# EAGLE design mbeduino010.eagle6 (EAGLE 6.5.0)
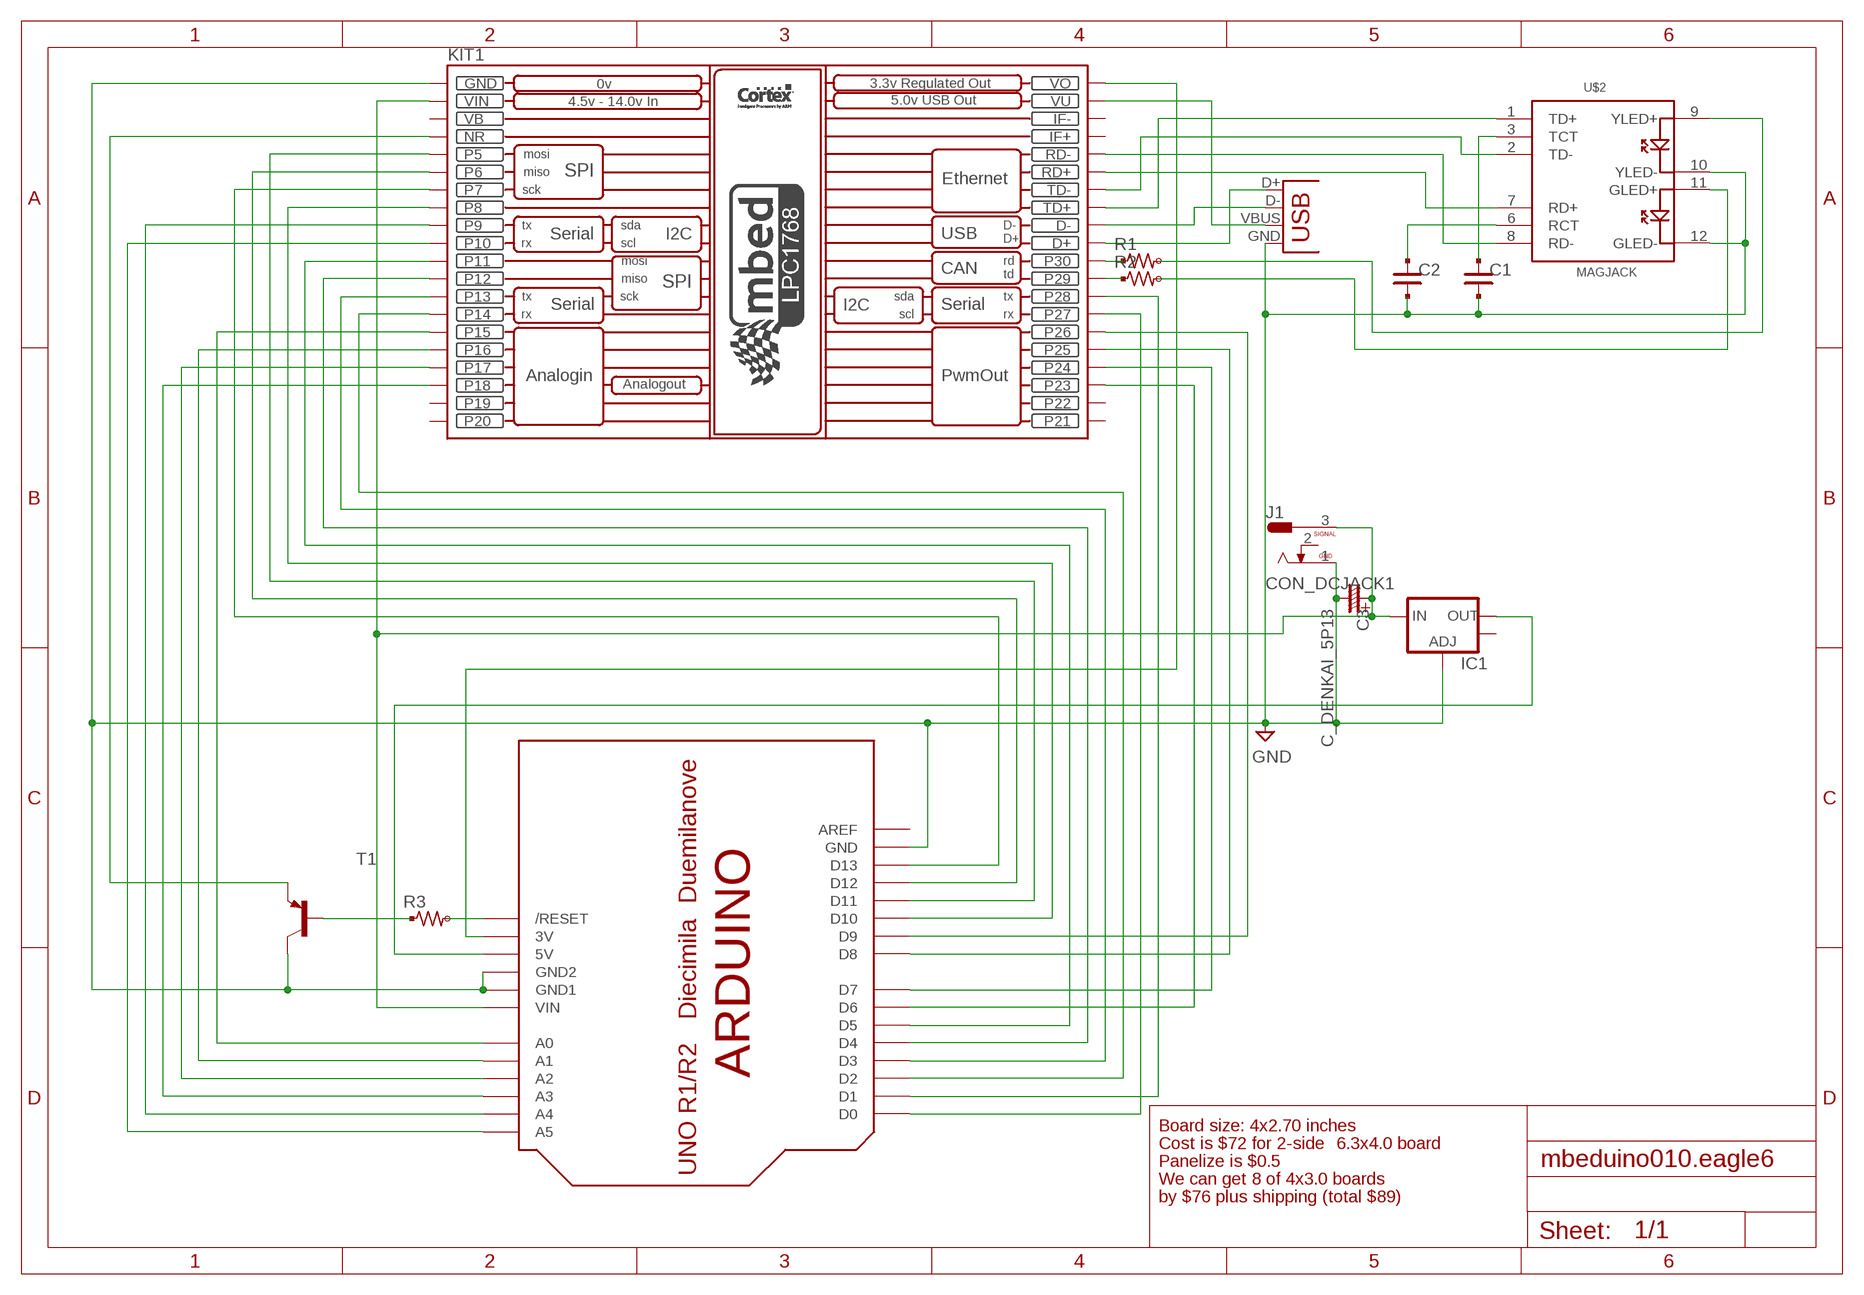
[diagram p0: schematic, sheet 1]

## Parts
C1  C_PAD_PAD_2125  [CR_2125]
C2  C_PAD_PAD_2125  [CR_2125]
C3  C_DENKAI_5P13  C_DENKAI_2.5P6  [C_2.5PHI6]
IC1  V_REG_LM1117SOT223  [SOT223]
J1  CON_DCJACK1  [CON_DCJACK]
KIT1  MBED_NXP_LPC1768  [MBED-KIT]
R1  R_US_PAD_VIA_2125  [R_2125_PADVIA]
R2  R_US_PAD_VIA_2125  [R_2125_PADVIA]
R3  R_US_PAD_VIA_2125  [R_2125_PADVIA]
T1  -PNP-SOT23-BCE  [SOT23-BCE]
U$1  ARDUINO-NOHOLE  [ARDUINO-NOHOLE]
U$2  MAGJACK  [MAGJACK]
X1  USB-A-S  [USB-A-S]

## Nets
GND: C1.2 C2.2 C3.- IC1.1(ADJ) J1.1 KIT1.GND T1.C U$1.GND U$1.GND1 U$1.GND2 U$2.10(YLED-) U$2.12(GLED-) X1.GND
N$1: KIT1.NR T1.E
N$2: C3.+ IC1.3(IN) J1.3 KIT1.VIN U$1.VIN
N$3: KIT1.VOUT(VO) U$1.3V
N$4: KIT1.P$15(P15) U$1.A0
N$5: KIT1.P$16(P16) U$1.A1
N$6: KIT1.P$17(P17) U$1.A2
N$7: KIT1.P$18(P18) U$1.A3
N$8: KIT1.P$9(P9) U$1.A4
N$9: KIT1.P$10(P10) U$1.A5
N$10: KIT1.P$27(P27) U$1.D0
N$11: KIT1.P$28(P28) U$1.D1
N$12: KIT1.P$14(P14) U$1.D2
N$13: KIT1.P$13(P13) U$1.D3
N$14: KIT1.P$12(P12) U$1.D4
N$15: KIT1.P$11(P11) U$1.D5
N$16: KIT1.P$23(P23) U$1.D6
N$17: KIT1.P$24(P24) U$1.D7
N$18: KIT1.P$25(P25) U$1.D8
N$19: KIT1.P$26(P26) U$1.D9
N$20: KIT1.P$8(P8) U$1.D10
N$21: KIT1.P$5(P5) U$1.D11
N$22: KIT1.P$6(P6) U$1.D12
N$23: KIT1.P$7(P7) U$1.D13
N$24: KIT1.D- X1.D-
N$25: KIT1.D+ X1.D+
N$26: KIT1.VU X1.VBUS
N$27: R3.PAD T1.B
N$28: R3.VIA U$1.RESET(/RESET)
N$29: C1.1 U$2.3(TCT)
N$30: C2.1 U$2.6(RCT)
N$31: KIT1.RD+ U$2.7(RD+)
N$32: KIT1.RD- U$2.8(RD-)
N$33: KIT1.TD- U$2.2(TD-)
N$34: KIT1.TD+ U$2.1(TD+)
N$35: IC1.2(OUT) U$1.5V
N$36: KIT1.P$30(P30) R1.PAD
N$37: KIT1.P$29(P29) R2.PAD
N$39: R1.VIA U$2.9(YLED+)
N$40: R2.VIA U$2.11(GLED+)
Unconnected: IC1.4(OUT) J1.2 KIT1.IF+ KIT1.IF- KIT1.P$19(P19) KIT1.P$20(P20) KIT1.P$21(P21) KIT1.P$22(P22) U$1.AREF

## Notes on the sheet
- Board size: 4x2.70 inches
- Cost is $72 for 2-side | 6.3x4.0 board
- Panelize is $0.5
- We can get 8 of 4x3.0 boards
- by $76 plus shipping (total $89)

## Power pins joined to a net without a drawn wire
VB: KIT1.VB

## Library data of the parts
C1 C2 = mylib:C_PAD_PAD_: SMD CAPACITOR : PAD - PAD
C3 = mylib:C_DENKAI: (Device name) : (Main function of the device) Packages : (Variant name1) : (Pitch) x (Pin) x (Width) (Variant name2) : (Pitch) x (Pin) x (Width) (Variant name3) : (Pitch) x (Pin) x (Width) ...
IC1 = SparkFun:V_REG_LM1117: Voltage Regulator LM1117 Standard adjustable voltage regulator but in SMD form. Spark Fun Electronics SKU : COM-00595
J1 = mylib:CON_DCJACK: DC JACK : 2.1 / 2.5 mm
KIT1 = MBED_v2.1:MBED_NXP_LPC1768: Mbed LPC1768 - ARM CORTEX v2.1 * Schematic symbol is now placed in eagles's default raster. *The pads diameter are suitable for routing between mbed pins * mbed pads are 0.8 mm drill diameter. --------------------------------------------- Created by: Mohamed Yousry *Alexandria, Egypt *Email: mohamed.yousry@ieeegoldegypt.org
R1-R3 = mylib:R_US_PAD_VIA: R_US_PAD_PAD : SMD R PAD is TH-NTH Packages : _1608 : 1.6 x 0.8 mm _2125 : 2.0 x 1.25 mm _3216 : 3.2 x 1.6 mm
T1 = transistor:*-PNP-: PNP Transistror
U$1 = adafruit (1):ARDUINO: Arduino Diecimila/Duemilanove Make a shield with ease, this package has all the named pins as well as the two mounting drill holes and an outline of the USB and DC power connector. The outline is on the DIMENSION layer, so if your board house uses it they will cut the outline to match. http://www.ladyada.net/library/pcb/eaglelibrary.html
U$2 = SparkFun:MAGJACK
X1 = SparkFun:USB: USB Connectors USB-B-PTH is fully proven SKU : PRT-00139 USB-miniB is fully proven SKU : PRT-00587 USB-A-PCB is untested. USB-A-H is throughly reviewed, but untested. Spark Fun Electronics SKU : PRT-00437 USB-B-SMT is throughly reviewed, but untested. Needs silkscreen touching up. USB-A-S has not been used/tested USB-MB-H has not been used/tested

## Net classes
0 signal: width 0.406 mm, drill 0.61 mm
1 power: width 0.813 mm, drill 0.61 mm

## Board
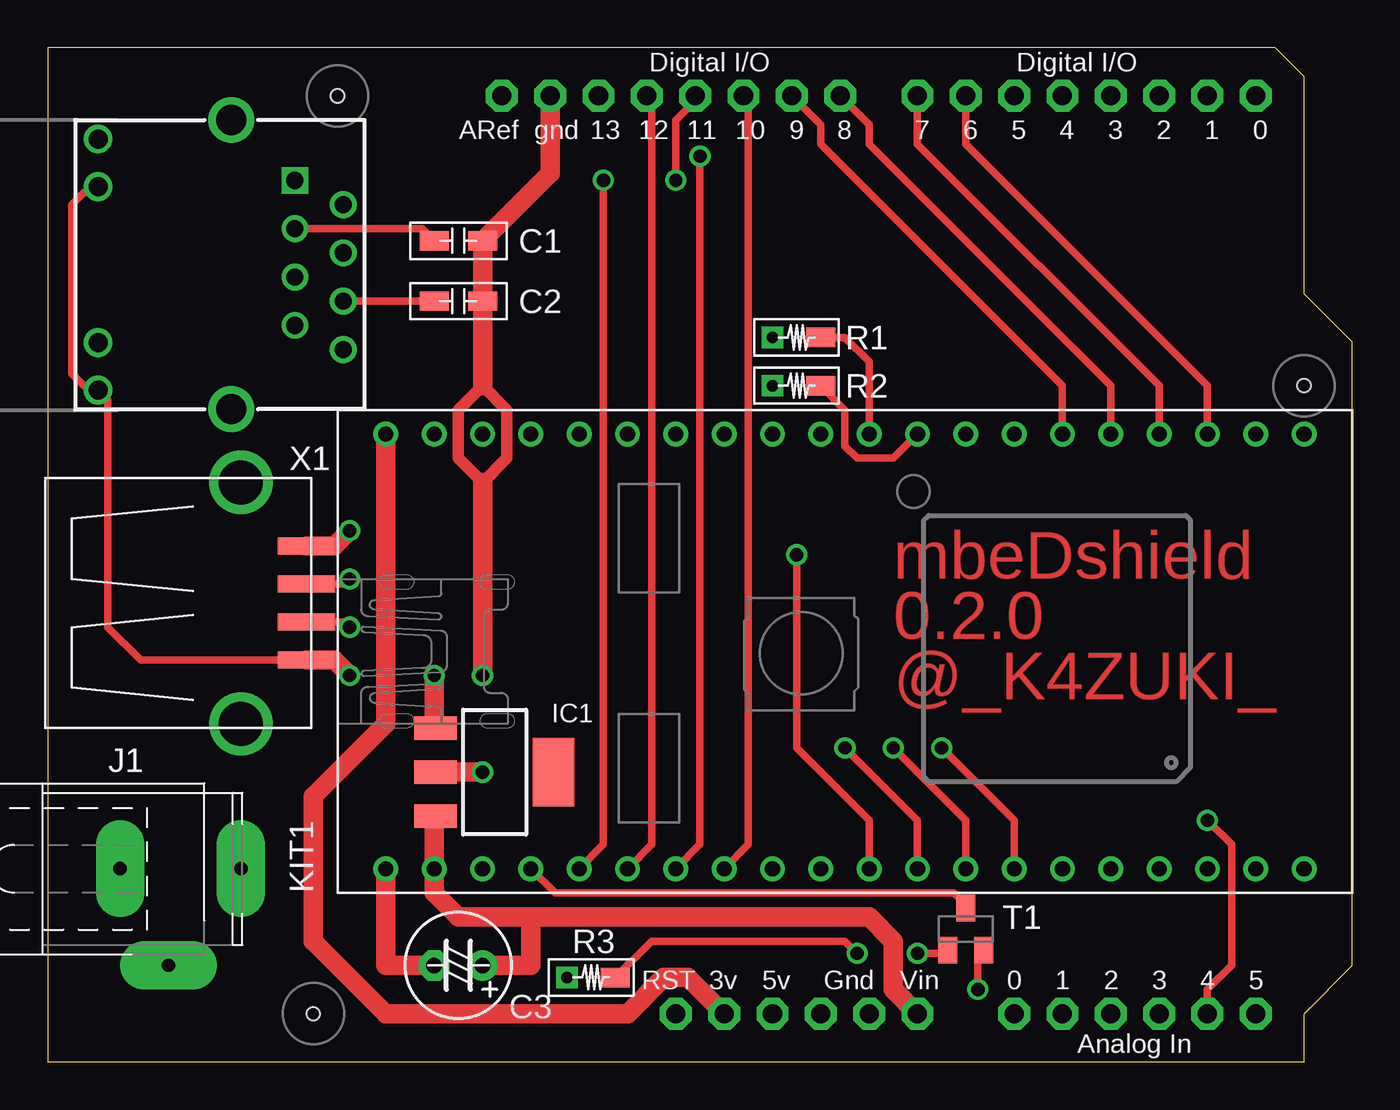
[diagram p1: board, top side]
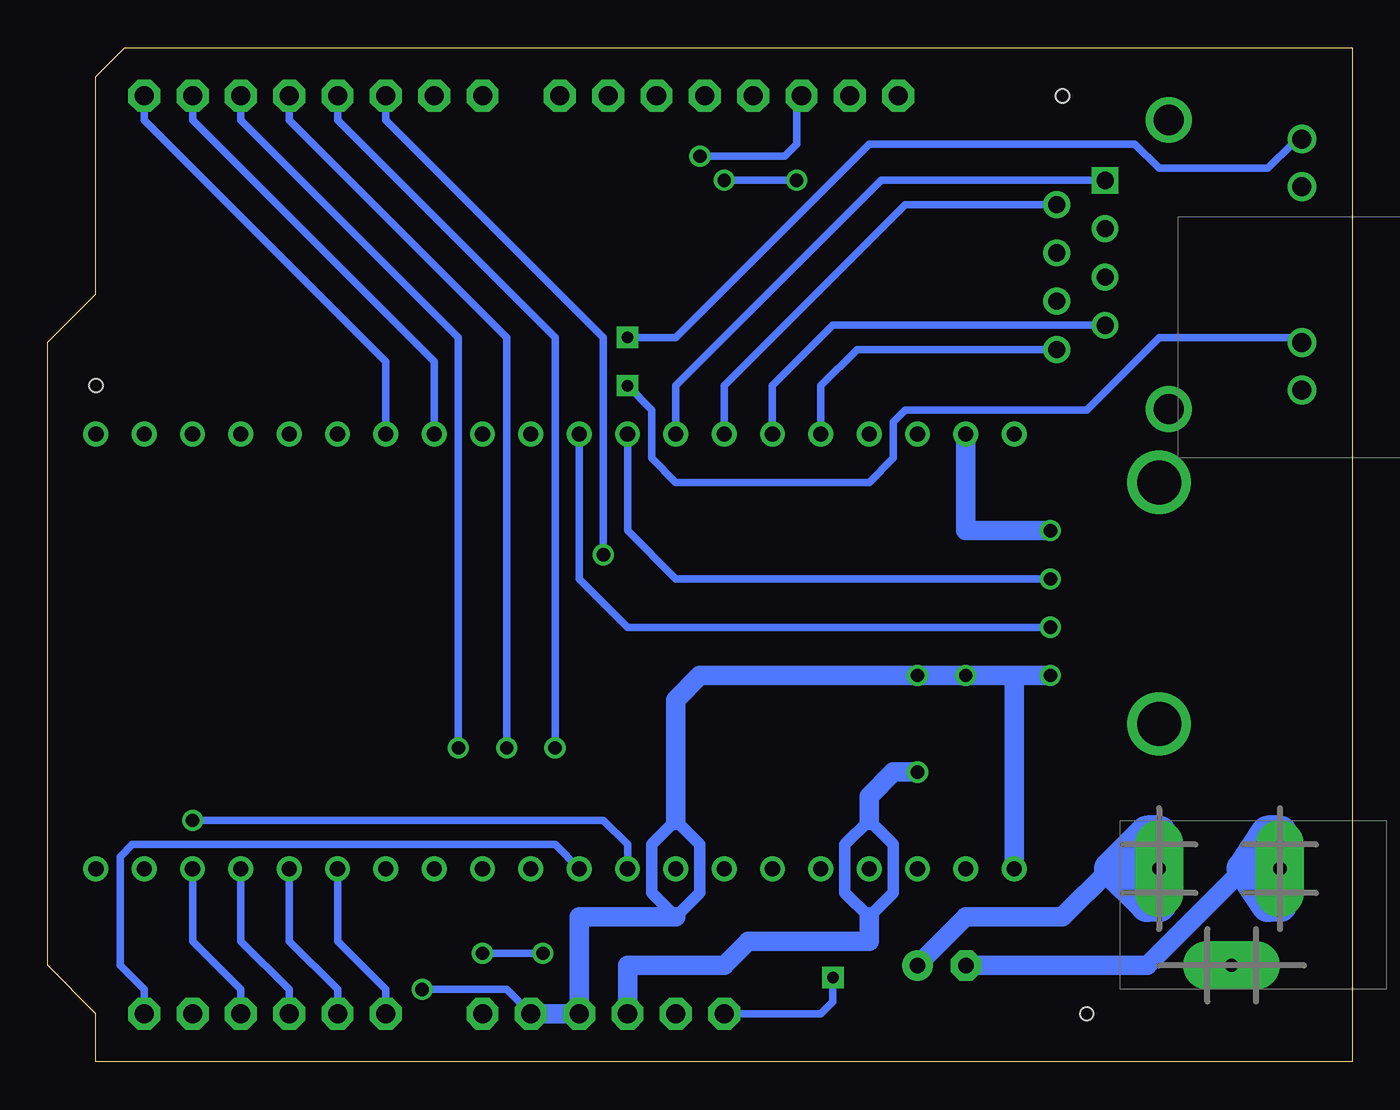
[diagram p2: board, bottom side, seen from below]

Size 68.58 x 53.34 mm. Coordinates in mm from the lower left corner, seen from the top.
Copper layers (1*16): Top 0.0356mm / dielectric 1.5011mm / Bottom 0.0356mm
Design rules "SilverCircuits *": minimum track width 10mil, minimum drill 24mil, track to track 8mil, track to pad 8mil, pad to pad 8mil, via to via 8mil, smd to smd 8mil, copper to edge 40mil, drill to drill 8mil, minimum pad ring 10mil, minimum via ring 8mil, stop-mask expansion 4mil, vias tented up to drill 100mil, thermal gap 10mil
Holes 0.7 mm at 66.04,35.56 13.97,2.54 15.24,50.8

### Footprints (pad centres in the part's own frame; a part is rotated, then mirrored left to right if it is on the bottom)
CR_2125 = smd 1.524 x 1.016: 1 -1.27,0; 2 1.27,0
C_2.5PHI6 = drill 0.813 pad 1.6: + -1.27,0 | drill 0.813 pad 1.6 octagon: - 1.27,0
SOT223 = smd 1.219 x 2.235: 1 -2.311,-3.099; 2 0,-3.099; 3 2.311,-3.099 | smd 3.6 x 2.2: 4 0,3.099
CON_DCJACK = drill 0.7 pad 2.54 long: 1 -0.635,0; 2 1.905,-5.08; 3 5.715,0
MBED-KIT = drill 0.8: D+ 11.43,1.27; D- 11.43,3.81; GND -11.43,24.13; IF+ 11.43,16.51; IF- 11.43,19.05; NR -11.43,16.51; P$5 -11.43,13.97; P$6 -11.43,11.43; P$7 -11.43,8.89; P$8 -11.43,6.35; P$9 -11.43,3.81; P$10 -11.43,1.27; P$11 -11.43,-1.27; P$12 -11.43,-3.81; P$13 -11.43,-6.35; P$14 -11.43,-8.89; P$15 -11.43,-11.43; P$16 -11.43,-13.97; P$17 -11.43,-16.51; P$18 -11.43,-19.05; P$19 -11.43,-21.59; P$20 -11.43,-24.13; P$21 11.43,-24.13; P$22 11.43,-21.59; P$23 11.43,-19.05; P$24 11.43,-16.51; P$25 11.43,-13.97; P$26 11.43,-11.43; P$27 11.43,-8.89; P$28 11.43,-6.35; P$29 11.43,-3.81; P$30 11.43,-1.27; RD+ 11.43,11.43; RD- 11.43,13.97; TD+ 11.43,6.35; TD- 11.43,8.89; VB -11.43,19.05; VIN -11.43,21.59; VOUT 11.43,24.13; VU 11.43,21.59
R_2125_PADVIA = smd 1.524 x 1.016: PAD 1.27,0 | drill 0.61 square: VIA -1.27,0
SOT23-BCE = smd 1 x 1.4: B -0.95,-1.1; C 0.95,-1.1; E 0,1.1
ARDUINO-NOHOLE = drill 1 pad 1.676 octagon: 3V 35.56,2.54; 5V 38.1,2.54; A0 50.8,2.54; A1 53.34,2.54; A2 55.88,2.54; A3 58.42,2.54; A4 60.96,2.54; A5 63.5,2.54; AREF 23.876,50.8; D0 63.5,50.8; D1 60.96,50.8; D2 58.42,50.8; D3 55.88,50.8; D4 53.34,50.8; D5 50.8,50.8; D6 48.26,50.8; D7 45.72,50.8; D8 41.656,50.8; D9 39.116,50.8; D10 36.576,50.8; D11 34.036,50.8; D12 31.496,50.8; D13 28.956,50.8; GND 26.416,50.8; GND1 43.18,2.54; GND2 40.64,2.54; RESET 33.02,2.54; VIN 45.72,2.54
MAGJACK = drill 0.9 square: 1 3.175,17.445 | drill 0.9: 2 4.445,19.985; 3 5.715,17.445; 4 6.985,19.985; 5 8.255,17.445; 6 9.525,19.985; 7 10.795,17.445; 8 12.065,19.985 | drill 1: 9 1,7.1; 10 3.5,7.1; 11 11.7,7.1; 12 14.2,7.1 | drill 1.6 pad 2.184: M1 0,14.1; M2 15.2,14.1
USB-A-S = smd 3 x 0.9: D+ 3.45,-1; D- 3.45,1; GND 3.45,-3; VBUS 3.45,3 | drill 2.311: P$1 0,6.35; P$2 0,-6.35

### Placement (x,y rotation side)
C1  21.59,43.18 0 top
C2  21.59,40.01 0 top
C3  21.59,5.08 180 top
IC1  23.5,15.24 270 top
J1  4.45,10.16 0 top
KIT1  41.91,21.59 90 top
R1  39.37,38.1 0 top
R2  39.37,35.56 0 top
R3  28.57,4.45 0 top
T1  48.26,6.99 0 top
U$1  0,0 0 top
U$2  -4.45,49.53 270 top
X1  10.16,24.13 0 top

### Tracks (layer width: path | path; a pad name or v marks a point on that pad's centre or on a via)
GND  (via drill 0.7)
  Top 0.406: U$2.10 2.65,45.84 2.54,45.72 1.91,45.72 1.27,45.09 1.27,36.2 1.91,35.56 2.42,35.56 U$2.12 3.17,34.81 3.17,22.86 4.91,21.13 X1.GND | v48.9,3.81 48.9,5.57 T1.C
  Top 0.61: 22.86,30.48 21.59,31.75 21.59,34.29 22.86,35.56 24.13,34.29 24.13,31.75 22.86,30.48
  Top 1.016: 22.86,35.56 C2.2 C1.2 26.42,46.74 U$1.GND | X1.GND 15.06,21.13 v15.88,20.32 | v22.86,20.32 22.86,30.48 | KIT1.GND 17.78,5.08 C3.- | v20.32,20.32 20.32,17.63 IC1.1
  Bottom 0.406: U$1.GND1 44.45,3.81 v48.9,3.81
  Bottom 0.61: 34.29,11.43 34.29,8.89 35.56,7.62 36.83,8.89 36.83,11.43 35.56,12.7 34.29,11.43
  Bottom 1.016: U$1.GND1 U$1.GND2 40.64,7.62 35.56,7.62 | 17.78,20.32 v15.88,20.32 | 17.78,20.32 v20.32,20.32 v22.86,20.32 34.29,20.32 35.56,19.05 35.56,12.7 | KIT1.GND 17.78,20.32 | 5.71,10.16 10.79,5.08 C3.-
  Bottom 1.778: 5.71,10.16 4.45,12.06 3.81,12.06 J1.1 | 5.71,10.16 4.45,8.26 3.81,8.26 J1.1 | J1.1 5.71,10.16
N$1
  Top 0.406: T1.E 48.26,8.26 47.62,8.89 26.67,8.89 KIT1.NR
N$2
  Top 1.016: U$1.VIN 44.45,3.81 44.45,6.35 43.18,7.62 25.4,7.62 | 25.4,7.62 21.59,7.62 20.32,8.89 KIT1.VIN 20.32,12.85 IC1.3 | C3.+ 25.4,5.08 25.4,7.62
  Bottom 1.016: 12.7,10.16 15.24,7.62 20.32,7.62 C3.+
  Bottom 1.778: 12.7,10.16 10.79,8.26 10.16,8.26 J1.3 | 12.7,10.16 10.79,12.06 10.16,12.06 J1.3 | J1.3 12.7,10.16
N$3
  Top 1.016: KIT1.VOUT 17.78,17.78 13.97,13.97 13.97,6.35 17.78,2.54 30.48,2.54 32.38,4.45 33.66,4.45 U$1.3V
N$4
  Bottom 0.406: U$1.A0 50.8,3.81 53.34,6.35 KIT1.P$15
N$5
  Bottom 0.406: U$1.A1 53.34,3.81 55.88,6.35 KIT1.P$16
N$6
  Bottom 0.406: U$1.A2 55.88,3.81 58.42,6.35 KIT1.P$17
N$7
  Bottom 0.406: U$1.A3 58.42,3.81 60.96,6.35 KIT1.P$18
N$8  (via drill 0.7)
  Top 0.406: U$1.A4 60.96,3.81 62.23,5.08 62.23,11.43 v60.96,12.7
  Bottom 0.406: v60.96,12.7 39.37,12.7 38.1,11.43 KIT1.P$9
N$9
  Bottom 0.406: U$1.A5 63.5,3.81 64.77,5.08 64.77,10.79 64.14,11.43 41.91,11.43 KIT1.P$10
N$10
  Bottom 0.406: U$1.D0 63.5,49.53 50.8,36.83 KIT1.P$27
N$11
  Bottom 0.406: U$1.D1 60.96,49.53 48.26,36.83 KIT1.P$28
N$12  (via drill 0.7)
  Top 0.406: KIT1.P$14 50.8,12.7 v46.99,16.51
  Bottom 0.406: v46.99,16.51 46.99,38.1 58.42,49.53 U$1.D2
N$13  (via drill 0.7)
  Top 0.406: KIT1.P$13 48.26,12.7 v44.45,16.51
  Bottom 0.406: v44.45,16.51 44.45,38.1 55.88,49.53 U$1.D3
N$14  (via drill 0.7)
  Top 0.406: KIT1.P$12 45.72,12.7 v41.91,16.51
  Bottom 0.406: v41.91,16.51 41.91,38.1 53.34,49.53 U$1.D4
N$15  (via drill 0.7)
  Top 0.406: KIT1.P$11 43.18,12.7 39.37,16.51 v39.37,26.67
  Bottom 0.406: v39.37,26.67 39.37,38.1 50.8,49.53 U$1.D5
N$16
  Top 0.406: KIT1.P$23 60.96,35.56 48.26,48.26 U$1.D6
N$17
  Top 0.406: KIT1.P$24 58.42,35.56 45.72,48.26 U$1.D7
N$18
  Top 0.406: KIT1.P$25 55.88,35.56 43.18,48.26 43.18,49.28 U$1.D8
N$19
  Top 0.406: KIT1.P$26 53.34,35.56 40.64,48.26 40.64,49.28 U$1.D9
N$20
  Top 0.406: KIT1.P$8 36.83,11.43 36.83,50.55 U$1.D10
N$21  (via drill 0.7)
  Top 0.406: KIT1.P$5 29.21,11.43 v29.21,46.35 | v33.02,46.35 33.02,49.53 34.04,50.55 U$1.D11
  Bottom 0.406: v29.21,46.35 v33.02,46.35
N$22
  Top 0.406: KIT1.P$6 31.75,11.43 31.75,50.55 U$1.D12
N$23  (via drill 0.7)
  Top 0.406: KIT1.P$7 34.29,11.43 v34.29,47.62
  Bottom 0.406: v34.29,47.62 29.84,47.62 29.21,48.26 29.21,50.55 U$1.D13
N$24  (via drill 0.7)
  Top 0.406: X1.D- 15.61,25.13 v15.88,25.4
  Bottom 0.406: KIT1.D- 38.1,27.94 35.56,25.4 v15.88,25.4
N$25  (via drill 0.7)
  Top 0.406: X1.D+ 15.61,23.13 v15.88,22.86
  Bottom 0.406: KIT1.D+ 40.64,25.4 38.1,22.86 v15.88,22.86
N$26  (via drill 0.7)
  Top 1.016: X1.VBUS 15.06,27.13 v15.88,27.94
  Bottom 1.016: KIT1.VU 20.32,27.94 v15.88,27.94
N$27  (via drill 0.7)
  Top 0.406: R3.PAD 31.75,6.35 41.91,6.35 v42.55,5.71 | v45.72,5.71 47.14,5.71 T1.B
  Bottom 0.406: v42.55,5.71 v45.72,5.71
N$28
  Bottom 0.406: U$1.RESET 27.94,2.54 27.3,3.17 R3.VIA
N$29
  Top 0.406: U$2.3 19.68,43.81 C1.1
N$30
  Top 0.406: U$2.6 C2.1
N$31
  Bottom 0.406: U$2.7 27.3,38.73 30.48,35.56 KIT1.RD+
N$32
  Bottom 0.406: KIT1.RD- 27.94,35.56 26.04,37.47 U$2.8
N$33
  Bottom 0.406: U$2.2 23.5,45.09 33.02,35.56 KIT1.TD-
N$34
  Bottom 0.406: KIT1.TD+ 35.56,35.56 24.77,46.35 U$2.1
N$35  (via drill 0.7)
  Top 1.016: v22.86,15.24 IC1.2
  Bottom 0.61: 24.13,8.89 25.4,7.62 26.67,8.89 26.67,11.43 25.4,12.7 24.13,11.43 24.13,8.89
  Bottom 1.016: U$1.5V 38.1,5.08 33.02,5.08 31.75,6.35 25.4,6.35 25.4,7.62 | 25.4,12.7 25.4,13.97 24.13,15.24 v22.86,15.24
N$36
  Top 0.406: KIT1.P$30 43.18,36.83 41.91,38.1 R1.PAD
N$37
  Top 0.406: R2.PAD 41.91,34.29 41.91,32.38 42.55,31.75 44.45,31.75 KIT1.P$29
N$39
  Bottom 0.406: R1.VIA 35.56,38.1 25.4,48.26 11.43,48.26 10.16,46.99 4.45,46.99 3.17,48.26 2.92,48.26 U$2.9
N$40
  Bottom 0.406: R2.VIA 36.83,34.29 36.83,31.75 35.56,30.48 25.4,30.48 24.13,31.75 24.13,33.66 23.5,34.29 13.97,34.29 10.16,38.1 3.17,38.1 2.9,37.83 U$2.11

### Text on the board
Top: mbeDshield | 0.2.0 | @_K4ZUKI_